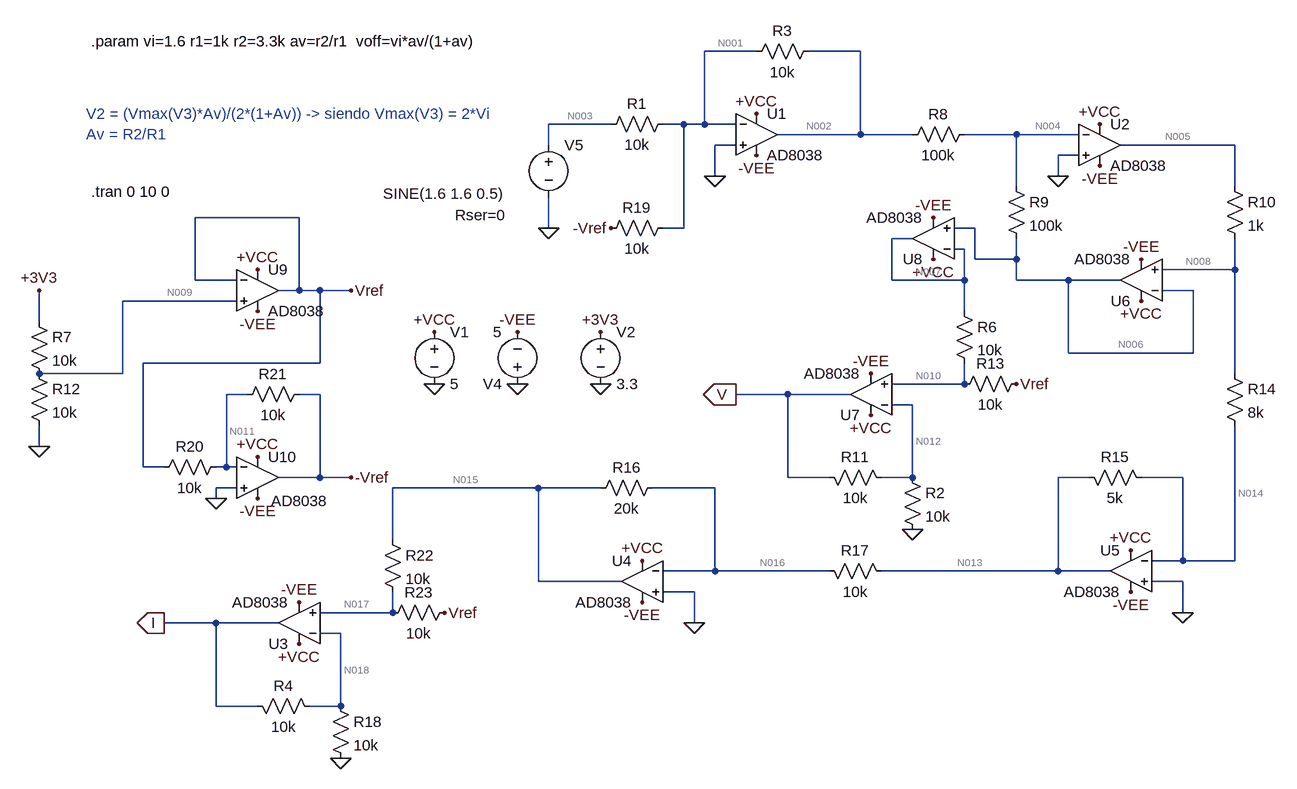
[diagram p0: schematic potenciostatov2.asc]
potenciostatov2.asc, the LTspice schematic file:
Version 4
SHEET 1 19688 724
WIRE -912 -384 -992 -384
WIRE -752 -384 -832 -384
WIRE -1136 -272 -1232 -272
WIRE -1024 -272 -1056 -272
WIRE -992 -272 -992 -384
WIRE -992 -272 -1024 -272
WIRE -944 -272 -992 -272
WIRE -752 -256 -752 -384
WIRE -752 -256 -880 -256
WIRE -672 -256 -752 -256
WIRE -512 -256 -592 -256
WIRE -416 -256 -512 -256
WIRE -1232 -240 -1232 -272
WIRE -944 -240 -976 -240
WIRE -176 -240 -352 -240
WIRE -416 -224 -448 -224
WIRE -976 -192 -976 -240
WIRE -448 -192 -448 -224
WIRE -512 -176 -512 -256
WIRE -176 -176 -176 -240
WIRE -1616 -128 -1776 -128
WIRE -1232 -112 -1232 -160
WIRE -1024 -112 -1024 -272
WIRE -1024 -112 -1056 -112
WIRE -576 -112 -608 -112
WIRE -672 -96 -704 -96
WIRE -592 -80 -608 -80
WIRE -576 -64 -576 -112
WIRE -512 -64 -512 -96
WIRE -512 -64 -576 -64
WIRE -176 -48 -176 -96
WIRE -176 -48 -288 -48
WIRE -1776 -32 -1776 -128
WIRE -1712 -32 -1776 -32
WIRE -704 -32 -704 -96
WIRE -592 -32 -592 -80
WIRE -592 -32 -704 -32
WIRE -512 -32 -512 -64
WIRE -432 -32 -512 -32
WIRE -352 -32 -432 -32
WIRE -1616 -16 -1616 -128
WIRE -1616 -16 -1648 -16
WIRE -1584 -16 -1616 -16
WIRE -1536 -16 -1584 -16
WIRE -240 -16 -288 -16
WIRE -1712 0 -1888 0
WIRE -592 16 -592 -32
WIRE -2016 32 -2016 -16
WIRE -432 80 -432 -32
WIRE -240 80 -240 -16
WIRE -240 80 -432 80
WIRE -1584 96 -1584 -16
WIRE -1584 96 -1856 96
WIRE -1888 112 -1888 0
WIRE -1888 112 -2016 112
WIRE -176 112 -176 -48
WIRE -592 128 -592 96
WIRE -592 128 -704 128
WIRE -1696 144 -1728 144
WIRE -1584 144 -1616 144
WIRE -864 144 -944 144
WIRE -768 144 -864 144
WIRE -672 160 -704 160
WIRE -2016 224 -2016 192
WIRE -1856 256 -1856 96
WIRE -1824 256 -1856 256
WIRE -1728 256 -1728 144
WIRE -1728 256 -1744 256
WIRE -1712 256 -1728 256
WIRE -1584 272 -1584 144
WIRE -1584 272 -1648 272
WIRE -1536 272 -1584 272
WIRE -864 272 -864 144
WIRE -800 272 -864 272
WIRE -672 272 -672 160
WIRE -672 272 -720 272
WIRE -400 272 -448 272
WIRE -256 272 -320 272
WIRE -1712 288 -1744 288
WIRE -1248 288 -1472 288
WIRE -1152 288 -1248 288
WIRE -976 288 -1072 288
WIRE -1744 304 -1744 288
WIRE -1472 368 -1472 288
WIRE -256 400 -256 272
WIRE -256 400 -304 400
WIRE -176 400 -176 192
WIRE -176 400 -256 400
WIRE -976 416 -976 288
WIRE -976 416 -1056 416
WIRE -800 416 -976 416
WIRE -448 416 -448 272
WIRE -448 416 -720 416
WIRE -368 416 -448 416
WIRE -1248 432 -1248 288
WIRE -1120 432 -1248 432
WIRE -256 432 -304 432
WIRE -1008 448 -1056 448
WIRE -1472 480 -1472 448
WIRE -1472 480 -1584 480
WIRE -256 480 -256 432
WIRE -1744 496 -1824 496
WIRE -1648 496 -1744 496
WIRE -1008 496 -1008 448
WIRE -1552 512 -1584 512
WIRE -1744 624 -1744 496
WIRE -1680 624 -1744 624
WIRE -1552 624 -1552 512
WIRE -1552 624 -1600 624
FLAG -912 -288 +VCC
FLAG -1408 128 0
FLAG -1408 48 +VCC
FLAG -1280 128 0
FLAG -1280 48 -VEE
FLAG -912 -224 -VEE
FLAG -1232 -112 0
FLAG -384 -272 +VCC
FLAG -384 -208 -VEE
FLAG -448 -192 0
FLAG -320 0 +VCC
FLAG -320 -64 -VEE
FLAG -736 176 +VCC
FLAG -736 112 -VEE
FLAG -944 144 V
IOPIN -944 144 Out
FLAG -336 384 +VCC
FLAG -336 448 -VEE
FLAG -256 480 0
FLAG -1088 400 +VCC
FLAG -1088 464 -VEE
FLAG -1008 496 0
FLAG -640 -64 +VCC
FLAG -640 -128 -VEE
FLAG -512 128 Vref
FLAG -1136 -112 -Vref
FLAG -2016 224 0
FLAG -1536 -16 Vref
FLAG -1680 -48 +VCC
FLAG -1680 16 -VEE
FLAG -672 352 0
FLAG -976 -192 0
FLAG -1536 272 -Vref
FLAG -1680 240 +VCC
FLAG -1680 304 -VEE
FLAG -1744 304 0
FLAG -1616 528 +VCC
FLAG -1616 464 -VEE
FLAG -1824 496 I
IOPIN -1824 496 Out
FLAG -1392 480 Vref
FLAG -1552 704 0
FLAG -1152 128 0
FLAG -1152 48 +3V3
FLAG -2016 -16 +3V3
SYMBOL voltage -1408 32 R0
WINDOW 123 0 0 Left 2
WINDOW 39 0 0 Left 2
SYMATTR InstName V1
SYMATTR Value 5
SYMBOL res -816 -400 R90
WINDOW 0 0 56 VBottom 2
WINDOW 3 32 56 VTop 2
SYMATTR InstName R3
SYMATTR Value 10k
SYMBOL voltage -1280 144 R180
WINDOW 123 0 0 Left 2
WINDOW 39 0 0 Left 2
SYMATTR InstName V4
SYMATTR Value 5
SYMBOL voltage -1232 -256 R0
WINDOW 123 0 0 Left 2
WINDOW 39 -144 124 Left 2
WINDOW 3 -255 91 Left 2
SYMATTR SpiceLine Rser=0
SYMATTR Value SINE(1.6 1.6 0.5)
SYMATTR InstName V5
SYMBOL res -576 -272 R90
WINDOW 0 0 56 VBottom 2
WINDOW 3 32 56 VTop 2
SYMATTR InstName R8
SYMATTR Value 100k
SYMBOL res -528 -192 R0
SYMATTR InstName R9
SYMATTR Value 100k
SYMBOL res -192 -192 R0
SYMATTR InstName R10
SYMATTR Value 1k
SYMBOL res -816 256 M90
WINDOW 0 0 56 VBottom 2
WINDOW 3 32 56 VTop 2
SYMATTR InstName R11
SYMATTR Value 10k
SYMBOL res -192 96 R0
SYMATTR InstName R14
SYMATTR Value 8k
SYMBOL res -304 288 M270
WINDOW 0 32 56 VTop 2
WINDOW 3 0 56 VBottom 2
SYMATTR InstName R15
SYMATTR Value 5k
SYMBOL res -1168 304 R270
WINDOW 0 32 56 VTop 2
WINDOW 3 0 56 VBottom 2
SYMATTR InstName R16
SYMATTR Value 20k
SYMBOL res -704 432 M270
WINDOW 0 32 56 VTop 2
WINDOW 3 0 56 VBottom 2
SYMATTR InstName R17
SYMATTR Value 10k
SYMBOL res -1040 -288 R90
WINDOW 0 0 56 VBottom 2
WINDOW 3 32 56 VTop 2
SYMATTR InstName R1
SYMATTR Value 10k
SYMBOL OpAmps\\AD8038 -912 -320 R0
SYMATTR InstName U1
SYMBOL OpAmps\\AD8038 -384 -304 R0
SYMATTR InstName U2
SYMBOL OpAmps\\AD8038 -1088 368 M0
SYMATTR InstName U4
SYMBOL OpAmps\\AD8038 -336 352 M0
SYMATTR InstName U5
SYMBOL OpAmps\\AD8038 -320 32 R180
SYMATTR InstName U6
SYMBOL OpAmps\\AD8038 -736 208 R180
SYMATTR InstName U7
SYMBOL OpAmps\\AD8038 -640 -32 R180
SYMATTR InstName U8
SYMBOL res -688 256 R0
SYMATTR InstName R2
SYMATTR Value 10k
SYMBOL res -2032 16 R0
SYMATTR InstName R7
SYMATTR Value 10k
SYMBOL res -2032 96 R0
SYMATTR InstName R12
SYMATTR Value 10k
SYMBOL OpAmps\\AD8038 -1680 -80 R0
SYMATTR InstName U9
SYMBOL res -608 0 R0
SYMATTR InstName R6
SYMATTR Value 10k
SYMBOL res -496 112 R90
WINDOW 0 0 56 VBottom 2
WINDOW 3 32 56 VTop 2
SYMATTR InstName R13
SYMATTR Value 10k
SYMBOL res -1040 -128 R90
WINDOW 0 0 56 VBottom 2
WINDOW 3 32 56 VTop 2
SYMATTR InstName R19
SYMATTR Value 10k
SYMBOL OpAmps\\AD8038 -1680 208 R0
WINDOW 3 21 100 Left 2
SYMATTR InstName U10
SYMBOL res -1728 240 R90
WINDOW 0 0 56 VBottom 2
WINDOW 3 32 56 VTop 2
SYMATTR InstName R20
SYMATTR Value 10k
SYMBOL res -1600 128 R90
WINDOW 0 0 56 VBottom 2
WINDOW 3 32 56 VTop 2
SYMATTR InstName R21
SYMATTR Value 10k
SYMBOL res -1696 608 M90
WINDOW 0 0 56 VBottom 2
WINDOW 3 32 56 VTop 2
SYMATTR InstName R4
SYMATTR Value 10k
SYMBOL OpAmps\\AD8038 -1616 560 R180
SYMATTR InstName U3
SYMBOL res -1568 608 R0
SYMATTR InstName R18
SYMATTR Value 10k
SYMBOL res -1488 352 R0
SYMATTR InstName R22
SYMATTR Value 10k
SYMBOL res -1376 464 R90
WINDOW 0 0 56 VBottom 2
WINDOW 3 32 56 VTop 2
SYMATTR InstName R23
SYMATTR Value 10k
SYMBOL voltage -1152 32 R0
WINDOW 123 0 0 Left 2
WINDOW 39 0 0 Left 2
SYMATTR InstName V2
SYMATTR Value 3.3
TEXT -1936 -168 Left 2 !.tran 0 10 0
TEXT -1944 -288 Left 2 ;V2 = (Vmax(V3)*Av)/(2*(1+Av)) -> siendo Vmax(V3) = 2*Vi\nAv = R2/R1
TEXT -1936 -400 Left 2 !.param vi=1.6 r1=1k r2=3.3k av=r2/r1  voff=vi*av/(1+av)

The netlist it stands for:
* potenciostatov2.asc
V1 +VCC 0 5
R3 N002 N001 10k
V4 0 -VEE 5
V5 N003 0 SINE(1.6 1.6 0.5) Rser=0
R8 N004 N002 100k
R9 N004 N006 100k
R10 N005 N008 1k
R11 V N012 10k
R14 N008 N014 8k
R15 N014 N013 5k
R16 N015 N016 20k
R17 N013 N016 10k
R1 N001 N003 10k
XU1 0 N001 +VCC -VEE N002 AD8038  ; pins In+ In- V+ V- OUT
XU2 0 N004 +VCC -VEE N005 AD8038  ; pins In+ In- V+ V- OUT
XU4 0 N016 +VCC -VEE N015 AD8038  ; pins In+ In- V+ V- OUT
XU5 0 N014 +VCC -VEE N013 AD8038  ; pins In+ In- V+ V- OUT
XU6 N008 N006 +VCC -VEE N006 AD8038  ; pins In+ In- V+ V- OUT
XU7 N010 N012 +VCC -VEE V AD8038  ; pins In+ In- V+ V- OUT
XU8 N006 N007 +VCC -VEE N007 AD8038  ; pins In+ In- V+ V- OUT
R2 N012 0 10k
R7 +3V3 N009 10k
R12 N009 0 10k
XU9 N009 Vref +VCC -VEE Vref AD8038  ; pins In+ In- V+ V- OUT
R6 N007 N010 10k
R13 Vref N010 10k
R19 N001 -Vref 10k
XU10 0 N011 +VCC -VEE -Vref AD8038  ; pins In+ In- V+ V- OUT
R20 N011 Vref 10k
R21 -Vref N011 10k
R4 I N018 10k
XU3 N017 N018 +VCC -VEE I AD8038  ; pins In+ In- V+ V- OUT
R18 N018 0 10k
R22 N015 N017 10k
R23 Vref N017 10k
V2 +3V3 0 3.3
.tran 0 10 0
* V2 = (Vmax(V3)*Av)/(2*(1+Av)) -> siendo Vmax(V3) = 2*Vi
* Av = R2/R1
.param vi=1.6 r1=1k r2=3.3k av=r2/r1  voff=vi*av/(1+av)
.backanno
.end

* Results of the author's LTspice run, read from the files saved beside the schematic
* Operating Point, zero values left out:
*   V(+vcc) = 5 V
*   V(n002) = 46.06 mV
*   V(n001) = -28.1 µV
*   V(-vee) = -5 V
*   V(n003) = 1.6 V
*   V(n004) = 31.6 µV
*   V(n006) = -46 mV
*   V(n005) = -51.78 mV
*   V(n008) = -46.03 mV
*   V(v) = 1.6 V
*   V(n012) = 799.7 mV
*   V(n014) = -17.68 µV
*   V(n013) = 28.74 mV
*   V(n015) = -57.37 mV
*   V(n016) = 37.16 µV
*   V(n010) = 800.7 mV
*   V(n007) = -45.97 mV
*   V(+3v3) = 3.3 V
*   V(n009) = 1.649 V
*   V(vref) = 1.648 V
*   V(-vref) = -1.646 V
*   V(n011) = 1.008 mV
*   V(i) = 1.589 V
*   V(n018) = 794 mV
*   V(n017) = 795 mV
*   I(R23) = 85.32 µA
*   I(R22) = -85.24 µA
*   I(R18) = 79.4 µA
*   I(R4) = 79.48 µA
*   I(R21) = -164.7 µA
*   I(R20) = -164.7 µA
*   I(R19) = 164.6 µA
*   I(R13) = 84.75 µA
*   I(R6) = -84.67 µA
*   I(R12) = 164.9 µA
*   I(R7) = 165.1 µA
*   I(R2) = 79.97 µA
*   I(R1) = -160 µA
*   I(R17) = 2.87 µA
*   I(R16) = -2.87 µA
*   I(R15) = -5.751 µA
*   I(R14) = -5.751 µA
*   I(R11) = 80.05 µA
*   I(R10) = -5.756 µA
*   I(R9) = 460.3 nA
*   I(R8) = -460.3 nA
*   I(R3) = 4.609 µA
*   I(V2) = -165.1 µA
*   I(V5) = -160 µA
*   I(V4) = -10.38 mA
*   I(V1) = -10.38 mA
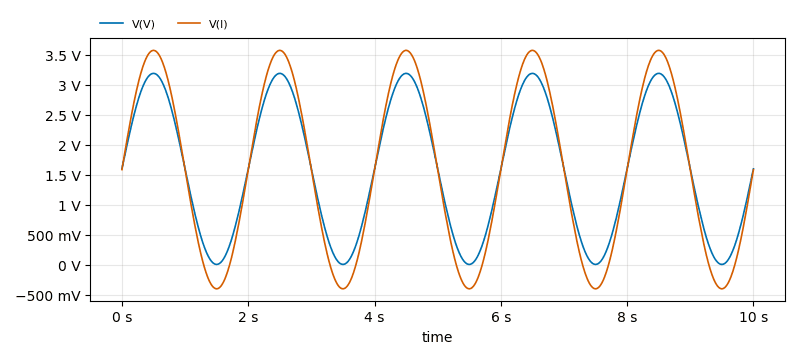
[diagram p1: Transient Analysis of potenciostatov2.asc, plotted from the saved traces]
* Transient Analysis, 1 run:
*   V(V): min 8.661 mV, max 3.192 V, average 1.6 V, rms 1.957 V, last 1.6 V
*   V(I): min -397.4 mV, max 3.575 V, average 1.589 V, rms 2.122 V, last 1.589 V